# Altium schematic sheet IMU.SchDoc
size A; SheetNumber: 7; SheetTotal: 10
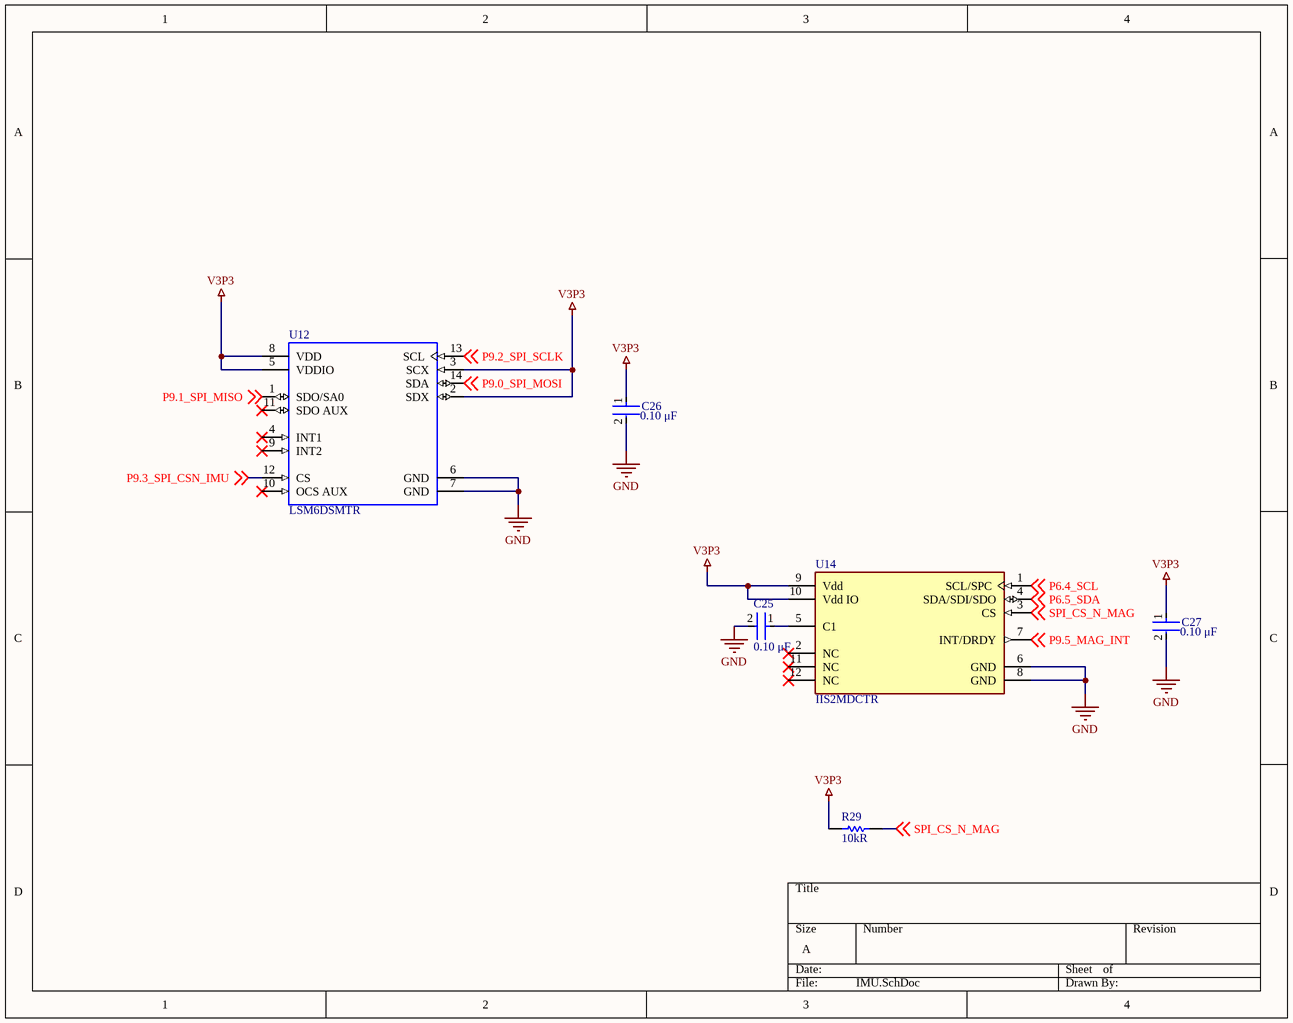
[diagram p0: IMU.SchDoc]

## Parts
C25  Capacitance: 0.10 μF  [FP-C0805C-DN-MFG]  (hidden comment: C0805C104K5RACTU)
C26  Capacitance: 0.10 μF  [FP-C0805C-DN-MFG]  (hidden comment: C0805C104K5RACTU)
C27  Capacitance: 0.10 μF  [FP-C0805C-DN-MFG]  (hidden comment: C0805C104K5RACTU)
R29  Resistance: 10kR  [RESC2013X60X35NL10T20]  (hidden comment: RC0805FR-0710KL)
U12  LSM6DSMTR  [LSM6DSMTR]
U14  IIS2MDCTR  [FP-LGA-12-DM00170568-MFG]

## Nets
GND: C25.2 C26.2 C27.2 U12.6(GND) U12.7(GND) U14.6(GND) U14.8(GND)
V3P3: C26.1 C27.1 R29.1 U12.2(SDX) U12.3(SCX) U12.5(VDDIO) U12.8(VDD) U14.9(Vdd) U14.10(Vdd_IO)
P6.4_SCL: U14.1(SCL/SPC) ; off-sheet P6.4_SCL
P6.5_SDA: U14.4(SDA/SDI/SDO) ; off-sheet P6.5_SDA
P9.0_SPI_MOSI: U12.14(SDA) ; off-sheet P9.0_SPI_MOSI
P9.1_SPI_MISO: U12.1(SDO/SA0) ; off-sheet P9.1_SPI_MISO
P9.2_SPI_SCLK: U12.13(SCL) ; off-sheet P9.2_SPI_SCLK
P9.3_SPI_CSN_IMU: U12.12(CS) ; off-sheet P9.3_SPI_CSN_IMU
P9.5_MAG_INT: U14.7(INT/DRDY) ; off-sheet P9.5_MAG_INT
SPI_CS_N_MAG: R29.2 U14.3(CS) ; off-sheet SPI_CS_N_MAG
NetC25_1: C25.1 U14.5(C1)

Not connected (* = marked no-connect by the designer): U12 4(INT1)* 9(INT2)* 10(OCS_AUX)* 11(SDO_AUX)*; U14 2(NC)* 11(NC)* 12(NC)*

## Library data of the parts
C25-C27 = CMP-2007-00279-2: CAP CER 0.1UF 50V X7R 0805; Manufacturer: KEMET; Value: 0.10 μF; Tolerance: 0.1; Temperature Coefficient: 30ppm/°C; Material: Ceramic; Voltage: 500V; Manufacturer Part Number: C0805C104K5RACTU; Device Class L2: Capacitors; Temperature Range Low: -55°C; Voltage Rating: 50 V; Digikey Description: CAP CER 0.1UF 50V X7R 0805; Category: Cap; ComponentLink2Description: Datasheet; Octopart: https://octopart.com/c0805c104k5ractu-kemet-143926; RoHS: TRUE; ComponentLink2URL: https://content.kemet.com/datasheets/KEM_C1003_C0G_SMD.pdf; Temperature Characteristic: X7R; Temperature: -55°C to +125°C; Height: 0.88mm; Temperature Range High: +125°C; Device Class L1: Passive Components; Automotive: No; Lead Free: Yes; Ipc Land Pattern Name: CAPC200125X78; Device Class L3: Ceramic Capacitors; Mouser Description: Cap Ceramic 0.1uF 50V X7R 10% SMD 2.0 x 1.2 mm 125 C Paper T/R; Package: C0805C-DN; Supplier: Digikey; Supplier Part Number: 399-C0805C104K5RAC7800CT-ND; Stock: 2466194; Pricing: 1=0.14, 10=0.091, 50=0.0546, 100=0.043, 500=0.03172, 1000=0.02627 (USD); Mounting Technology: Surface Mount,PCB; Case/Package: 0805; Pins: 2; Case Code (Imperial): 0805; Case Code (Metric): 2012; Min Operating Temperature: -55°C; Max Operating Temperature: 125°C; Dielectric: X7R; Package Quantity: 4000; Packaging: Tape and Reel; Voltage Rating (DC): 50V; Termination: SMD/SMT; Series: SMD Comm X7R; Construction: Flat; Length: 2mm; Width: 1.2mm; Depth: 1.25mm; Lead Pitch: 0.75mm; Radiation Hardening: No; RoHS Compliant: Yes; Reach SVHC Compliant: No; ComponentLink1URL: https://datasheet.ciiva.com/32431/slceramic-chip-condensers-e-32431755.pdf?src-supplier=Distrelec; ComponentLink1Description: https://datasheet.ciiva.com/32431/slceramic-chip-condensers-e-32431755.pdf?src-supplier=Distrelec; ComponentLink3URL: https://datasheet.ciiva.com/28682/1851736-28682232.pdf?src-supplier=Element14; ComponentLink3Description: https://datasheet.ciiva.com/28682/1851736-28682232.pdf?src-supplier=Element14; ComponentLink4URL: https://datasheet.ciiva.com/18410/70095383-18410815.pdf?src-supplier=Allied+Electronics; ComponentLink4Description: https://datasheet.ciiva.com/18410/70095383-18410815.pdf?src-supplier=Allied+Electronics; ComponentLink5URL: https://datasheet.ciiva.com/14589/70095383-14589048.pdf?src-supplier=Allied+Electronics; ComponentLink5Description: https://datasheet.ciiva.com/14589/70095383-14589048.pdf?src-supplier=Allied+Electronics
R29 = CMP-1659-00013-4: Chip Resistor, 10 KOhm, +/- 1%, 0.125 W, -55 to 155 degC, 0805 (2012 Metric), RoHS, Tape and Reel; Manufacturer: Yageo; Voltage Rating: 150 V; Power Rating: 125mW; Temperature Coefficient: 100ppm/°C; Mount: Surface Mount; ComponentLink1Description: Manufacturer URL; ComponentLink2URL: http://www.yageo.com/documents/recent/PYu-RC_Group_51_RoHS_L_04.pdf; Pins: 2; Length: 2 mm; Min Operating Temperature: -55 degC; Height: 0.5 mm; Mounting Technology: Surface Mount; RoHSCompliant: true; REACH SVHC: No SVHC; ComponentLink1URL: http://www.yageo.com/; Max Operating Temperature: 155 degC; PackageReference: 0805; DatasheetVersion: Rev. 4, 02/2016; Package Quantity: 5000; Packaging: Tape and Reel; ComponentLink2Description: Datasheet; PackageDescription: 2-Pin Surface Mounted Device, Body 2 x 1.25 mm; Supplier 1: Digi-Key; Supplier Part Number 1: 311-10.0KCRCT-ND; Manufacturer 1: Yageo; Manufacturer Part Number 1: RC0805FR-0710KL; RoHS: Yes; Category: Chip SMD Resistors; Stock 1: 12202331; Pricing 1: 1=0.10000, 10=0.03700, 100=0.01520, 1000=0.00682, 2500=0.00592 (USD); Case/Package: 0805; Case Code (Imperial): 0805; Case Code (Metric): 2012; Size Code: 0805; Tolerance: 1%; Termination: SMD/SMT; Series: RC; Max Power Dissipation: 125mW; Resistance Tolerance: 1%; Resistor Type: Thick Film; Number of Terminations: 2; Features: Moisture Resistant; Construction: Rectangular; Technology: THICK FILM; Width: 0.049inch; Depth: 1.25mm; RoHS Compliant: Yes; Lead Free: Lead Free; Military Standard: Not
U12 = IC-LSM6DSMTR: Analog Circuit, 1 Func, CMOS, PBGA14; Manufacturer: STMicroelectronics; Operating Supply Current: 0.29-0.65mA; Gyro Range: 125/250/500/1000/2000°/s; Sensor Output: I2C,SPI; Accel Range: 2/4/8/16g; Min Supply Voltage: 1.62V; Resolution: 16bits; Sensor Type: Temperature,Accelerometer,Gyroscope; Max Supply Voltage: 3.6V; Package Body Material: Plastic; Channels: 1; Nominal Supply Voltage: 1.8V; Manufacturer Part Number 1: LSM6DSMTR; Octopart: https://octopart.com/lsm6dsmtr-stmicroelectronics-66358194; Height: 0.86mm; Category: IC; Lead Free: Yes; Temperature: -40°C to +85°C; Temperature Range Low: -40°C; ComponentLink2Description: Datasheet; ComponentLink2URL: https://www.st.com/resource/en/datasheet/lsm6dsm.pdf; Digikey Description: IMU ACCEL/GYRO I2C/SPI 14LGA; Footprint Url: https://www.st.com/content/ccc/resource/technical/document/technical_note/73/17/9c/16/dd/96/4a/01/CD00134799.pdf/files/CD00134799.pdf/jcr:content/translations/en.CD00134799.pdf; Device Class L1: Sensors; Device Class L2: Motion Sensors; Temperature Range High: +85°C; Mouser Description: LSM6DSM Series 3.6 V I2C/SPI 3D Accelerometer and 3D Gyroscope - LGA-14; Device Class L3: Inertial Measurement Units (IMUs); Automotive: No; Package: LGA-14L-DM00249496; RoHS: TRUE; Supplier 1: Digikey; Supplier Part Number 1: 497-16696-1-ND; Stock: 16933; Pricing: 1=3.92, 10=2.965, 25=2.7248, 100=2.461, 250=2.33524, 500=2.25944, 1000=2.19705, 2500=2.13118 (USD); Case/Package: VFLGA; Pins: 14; Package Shape: Rectangular; Terminal Finish: Nickel; Min Operating Temperature: -40°C; Max Operating Temperature: 85°C; JESD-609 Code: e4; Throw Configuration: ANALOG CIRCUIT; Moisture Sensitivity Level: 3; Package Style: GRID ARRAY, VERY THIN PROFILE, FINE PITCHMeter; Peak Reflow Temperature (Cel): 260°C; Surface Mount: Yes; Technology: CMOS; Terminal Form: BUTT; Terminal Position: BOTTOM; Length: 3mm; Width: 2.5mm; Height - Seated (Max): 0.86mm; Terminal Pitch: 0.5mm; Temperature Grade: INDUSTRIAL; Reach SVHC Compliant: Yes; RoHS Compliant: Yes; ComponentLink1URL: https://datasheet.ciiva.com:443/pdfs/VipMasterIC/IC/SGST/SGST-S-A0003491949/SGST-S-A0003491926-1.pdf?src-supplier=IHS+Markit; ComponentLink1Description: https://datasheet.ciiva.com:443/pdfs/VipMasterIC/IC/SGST/SGST-S-A0003491949/SGST-S-A0003491926-1.pdf?src-supplier=IHS+Markit; ComponentLink3URL: http://www.farnell.com/datasheets/2151220.pdf?src-supplier=Farnell; ComponentLink3Description: http://www.farnell.com/datasheets/2151220.pdf?src-supplier=Farnell; ComponentLink4URL: https://www.mouser.com/ds/2/389/lsm6dsm-973702.pdf?src-supplier=Mouser; ComponentLink4Description: https://www.mouser.com/ds/2/389/lsm6dsm-973702.pdf?src-supplier=Mouser; ComponentLink5URL: http://www.st.com/content/ccc/resource/sales_and_marketing/promotional_material/flyer/7a/04/ee/af/e2/19/46/66/fllsm6dsm0216.pdf/files/fllsm6dsm0216.pdf/jcr:content/translations/en.fllsm6dsm0216.pdf?src-supplier=Digikey; ComponentLink5Description: http://www.st.com/content/ccc/resource/sales_and_marketing/promotional_material/flyer/7a/04/ee/af/e2/19/46/66/fllsm6dsm0216.pdf/files/fllsm6dsm0216.pdf/jcr:content/translations/en.fllsm6dsm0216.pdf?src-supplier=Digikey; ComponentLink6URL: http://www.st.com/content/ccc/resource/technical/document/datasheet/76/27/cf/88/c5/03/42/6b/DM00218116.pdf/files/DM00218116.pdf/jcr:content/translations/en.DM00218116.pdf?src-supplier=Digikey; ComponentLink6Description: http://www.st.com/content/ccc/resource/technical/document/datasheet/76/27/cf/88/c5/03/42/6b/DM00218116.pdf/files/DM00218116.pdf/jcr:content/translations/en.DM00218116.pdf?src-supplier=Digikey; ComponentLink7URL: https://datasheet.octopart.com/LSM6DSMTR-STMicroelectronics-datasheet-62333594.pdf?src-supplier=Newark; ComponentLink7Description: https://datasheet.octopart.com/LSM6DSMTR-STMicroelectronics-datasheet-62333594.pdf?src-supplier=Newark; ComponentLink8URL: http://www.farnell.com/datasheets/2151220.pdf?src-supplier=Newark; ComponentLink8Description: http://www.farnell.com/datasheets/2151220.pdf?src-supplier=Newark; ComponentLink9URL: https://datasheet.octopart.com/LSM6DSMTR-STMicroelectronics-datasheet-79471837.pdf?src-supplier=Future+Electronics; ComponentLink9Description: https://datasheet.octopart.com/LSM6DSMTR-STMicroelectronics-datasheet-79471837.pdf?src-supplier=Future+Electronics
U14 = CMP-12173-000003-1: SENSOR MR I2C/SPI 12LGA; Axis: X, Y, Z; Output Type: SPI; Sensing Method: Magnetoresistive; Resolution: 16b; Case/Package: LGA; Min Operating Temperature: -40°C; Packaging: Cut Tape; Number of Pins: 12; Max Operating Temperature: 85°C; RoHS Compliant: Yes